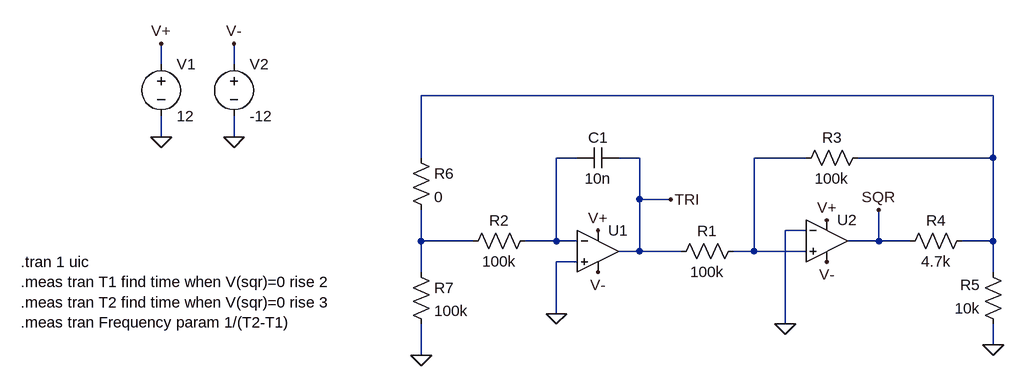
[diagram p0: schematic lfo_tri.asc]
lfo_tri.asc, the LTspice schematic file:
Version 4
SHEET 1 1028 680
WIRE -272 -176 -272 -208
WIRE -160 -176 -160 -208
WIRE 1008 -128 128 -128
WIRE -272 -64 -272 -96
WIRE -160 -64 -160 -96
WIRE 128 -32 128 -128
WIRE 368 -32 336 -32
WIRE 464 -32 432 -32
WIRE 720 -32 640 -32
WIRE 1008 -32 1008 -128
WIRE 1008 -32 800 -32
WIRE 464 32 464 -32
WIRE 512 32 464 32
WIRE 720 80 688 80
WIRE 128 96 128 48
WIRE 208 96 128 96
WIRE 336 96 336 -32
WIRE 336 96 288 96
WIRE 368 96 336 96
WIRE 832 96 832 48
WIRE 832 96 784 96
WIRE 880 96 832 96
WIRE 1008 96 1008 -32
WIRE 1008 96 960 96
WIRE 464 112 464 32
WIRE 464 112 432 112
WIRE 528 112 464 112
WIRE 640 112 640 -32
WIRE 640 112 608 112
WIRE 720 112 640 112
WIRE 368 128 336 128
WIRE 128 144 128 96
WIRE 1008 144 1008 96
WIRE 336 208 336 128
WIRE 688 224 688 80
WIRE 1008 256 1008 224
WIRE 128 272 128 224
FLAG -272 -64 0
FLAG -160 -64 0
FLAG -272 -208 V+
FLAG -160 -208 V-
FLAG 400 80 V+
FLAG 400 144 V-
FLAG 752 128 V-
FLAG 752 64 V+
FLAG 512 32 TRI
FLAG 336 208 0
FLAG 688 224 0
FLAG 1008 256 0
FLAG 832 48 SQR
FLAG 128 272 0
SYMBOL voltage -272 -192 R0
WINDOW 123 0 0 Left 0
WINDOW 39 0 0 Left 0
SYMATTR InstName V1
SYMATTR Value 12
SYMBOL voltage -160 -192 R0
WINDOW 123 0 0 Left 0
WINDOW 39 0 0 Left 0
SYMATTR InstName V2
SYMATTR Value -12
SYMBOL cap 432 -48 R90
WINDOW 0 0 32 VBottom 2
WINDOW 3 32 32 VTop 2
SYMATTR InstName C1
SYMATTR Value 10n
SYMBOL res 624 96 R90
WINDOW 0 0 56 VBottom 2
WINDOW 3 32 56 VTop 2
SYMATTR InstName R1
SYMATTR Value 100k
SYMBOL res 304 80 R90
WINDOW 0 0 56 VBottom 2
WINDOW 3 32 56 VTop 2
SYMATTR InstName R2
SYMATTR Value 100k
SYMBOL res 816 -48 R90
WINDOW 0 0 56 VBottom 2
WINDOW 3 32 56 VTop 2
SYMATTR InstName R3
SYMATTR Value 100k
SYMBOL res 976 80 R90
WINDOW 0 0 56 VBottom 2
WINDOW 3 32 56 VTop 2
SYMATTR InstName R4
SYMATTR Value 4.7k
SYMBOL res 1024 240 R180
WINDOW 0 36 76 Left 2
WINDOW 3 36 40 Left 2
SYMATTR InstName R5
SYMATTR Value 10k
SYMBOL res 112 -48 R0
SYMATTR InstName R6
SYMATTR Value 0
SYMBOL res 112 128 R0
SYMATTR InstName R7
SYMATTR Value 100k
SYMBOL OpAmps\\UniversalOpAmp2 400 112 R0
SYMATTR InstName U1
SYMBOL OpAmps\\UniversalOpAmp2 752 96 R0
SYMATTR InstName U2
TEXT -488 128 Left 2 !.tran 1 uic\n.meas tran T1 find time when V(sqr)=0 rise 2\n.meas tran T2 find time when V(sqr)=0 rise 3\n.meas tran Frequency param 1/(T2-T1)

The netlist it stands for:
* lfo_tri.asc
V1 V+ 0 12
V2 V- 0 -12
C1 TRI N002 10n
R1 N003 TRI 100k
R2 N002 N004 100k
R3 N001 N003 100k
R4 N001 SQR 4.7k
R5 0 N001 10k
R6 N001 N004 0
R7 N004 0 100k
XU1 0 N002 V+ V- TRI level2 Avol=1Meg GBW=10Meg Slew=10Meg Ilimit=25m Rail=0 Vos=0 En=0 Enk=0 In=0 Ink=0 Rin=500Meg  ; pins In+ In- V+ V- OUT
XU2 N003 0 V+ V- SQR level2 Avol=1Meg GBW=10Meg Slew=10Meg Ilimit=25m Rail=0 Vos=0 En=0 Enk=0 In=0 Ink=0 Rin=500Meg  ; pins In+ In- V+ V- OUT
.tran 1 uic
.meas tran T1 find time when V(sqr)=0 rise 2
.meas tran T2 find time when V(sqr)=0 rise 3
.meas tran Frequency param 1/(T2-T1)
.lib UniversalOpAmp2.lib
.backanno
.end